# Altium schematic sheet M3406-ADJ_3V3.SchDoc
size A4
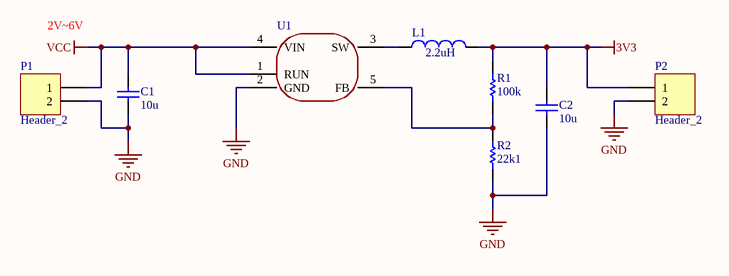
[diagram p0: M3406-ADJ_3V3.SchDoc]

## Parts
C1  value 10u  [CAP 0603_1608]  (hidden comment: Capacitor)
C2  value 10u  [CAP 0603_1608]  (hidden comment: Capacitor)
L1  value 2.2uH  [IND-SMD_L2.0-W1.6]  (hidden comment: Inductor)
P1  Header_2  [PAD_2.54mmx2]
P2  Header_2  [PAD_2.54mmx2]
R1  value 100k  [RES 0402_1005]  (hidden comment: Resistor)
R2  value 22k1  [RES 0402_1005]  (hidden comment: Resistor)
U1  M3406-ADJ  [SOT-23-5_L3.0-W1.7-P0.95-LS2.8-BR]  (value not drawn)

## Nets
3V3: C2.2 L1.2 P2.1 R1.2
GND: C1.1 C2.1 P1.2 P2.2 R2.1 U1.2(GND)
VCC: C1.2 P1.1 U1.1(RUN) U1.4(VIN)
NetL1_1: L1.1 U1.3(SW)
NetR1_1: R1.1 R2.2 U1.5(FB)

## Notes on the sheet
- 2V~6V

## Library data of the parts
C1 C2 = GRM188R61E106KA73D: Manufacturer: Murata; CPN: 10010500040; Tolerance: 10%; Temperature Coefficient: -15 to 15 %; Dielectric: X5R; Rated Voltage: 25V; MPN: GRM188R61E106KA73D; Category: MLCC; Case/Package: 0603; Length: 1.6; Width: 0.8; Height: 0.8; Min Operating Temperature: -55; Max Operating Temperature: +85; Mounting Type: SMD; RoHS Compliant: YES; Lead Free: YES
L1 = WPN201610U2R2MTY01: Manufacturer: Sunlord(顺络); Tolerance: 20%; DCR: 115mΩ; Rated Current: 2A; MPN: WPN201610U2R2MTY01; Category: Power Inductor; Case/Package: 201610; Length: 2; Width: 1.6; Height: 1; Min Operating Temperature: -40; Max Operating Temperature: +125; Mounting Type: SMD
P1 P2 = PAD_2.54MM_2: SMD，DIP; MPN: PAD_2.54MM_2; Mounting Type: 直插
R1 = RC0402FR-07100KL: Manufacturer: Yageo; CPN: 10010300020; Tolerance: 1%; Temperature Coefficient: 100 ppm/C; Rated Power: 62.5 mW (1/16 W); Rated Voltage: 50V; MPN: RC0402FR-07100KL; Case/Package: 0402; Length: 1.0; Width: 0.5; Height: 0.35; Min Operating Temperature: -55; Max Operating Temperature: +155; Mounting Type: SMD
R2 = RC0402FR-0722K1L: Manufacturer: Yageo; Tolerance: 1%; Temperature Coefficient: 100 ppm/C; Rated Power: 62.5 mW (1/16 W); Rated Voltage: 50V; MPN: RC0402FR-0722K1L; Case/Package: 0402; Length: 1.0; Width: 0.5; Height: 0.35; Min Operating Temperature: -55; Max Operating Temperature: +155; Mounting Type: SMD
U1 = M3406-ADJ: Vin=2V~6V,800mA,DCDC; Manufacturer: 西安航天民芯; Supply Voltage: 2V~6V; MPN: M3406-ADJ; Category: Step-Down Converter; Min Operating Temperature: -40; Max Operating Temperature: +85; Mounting Type: SMD